# Altium schematic sheet Audio.SchDoc
size Letter
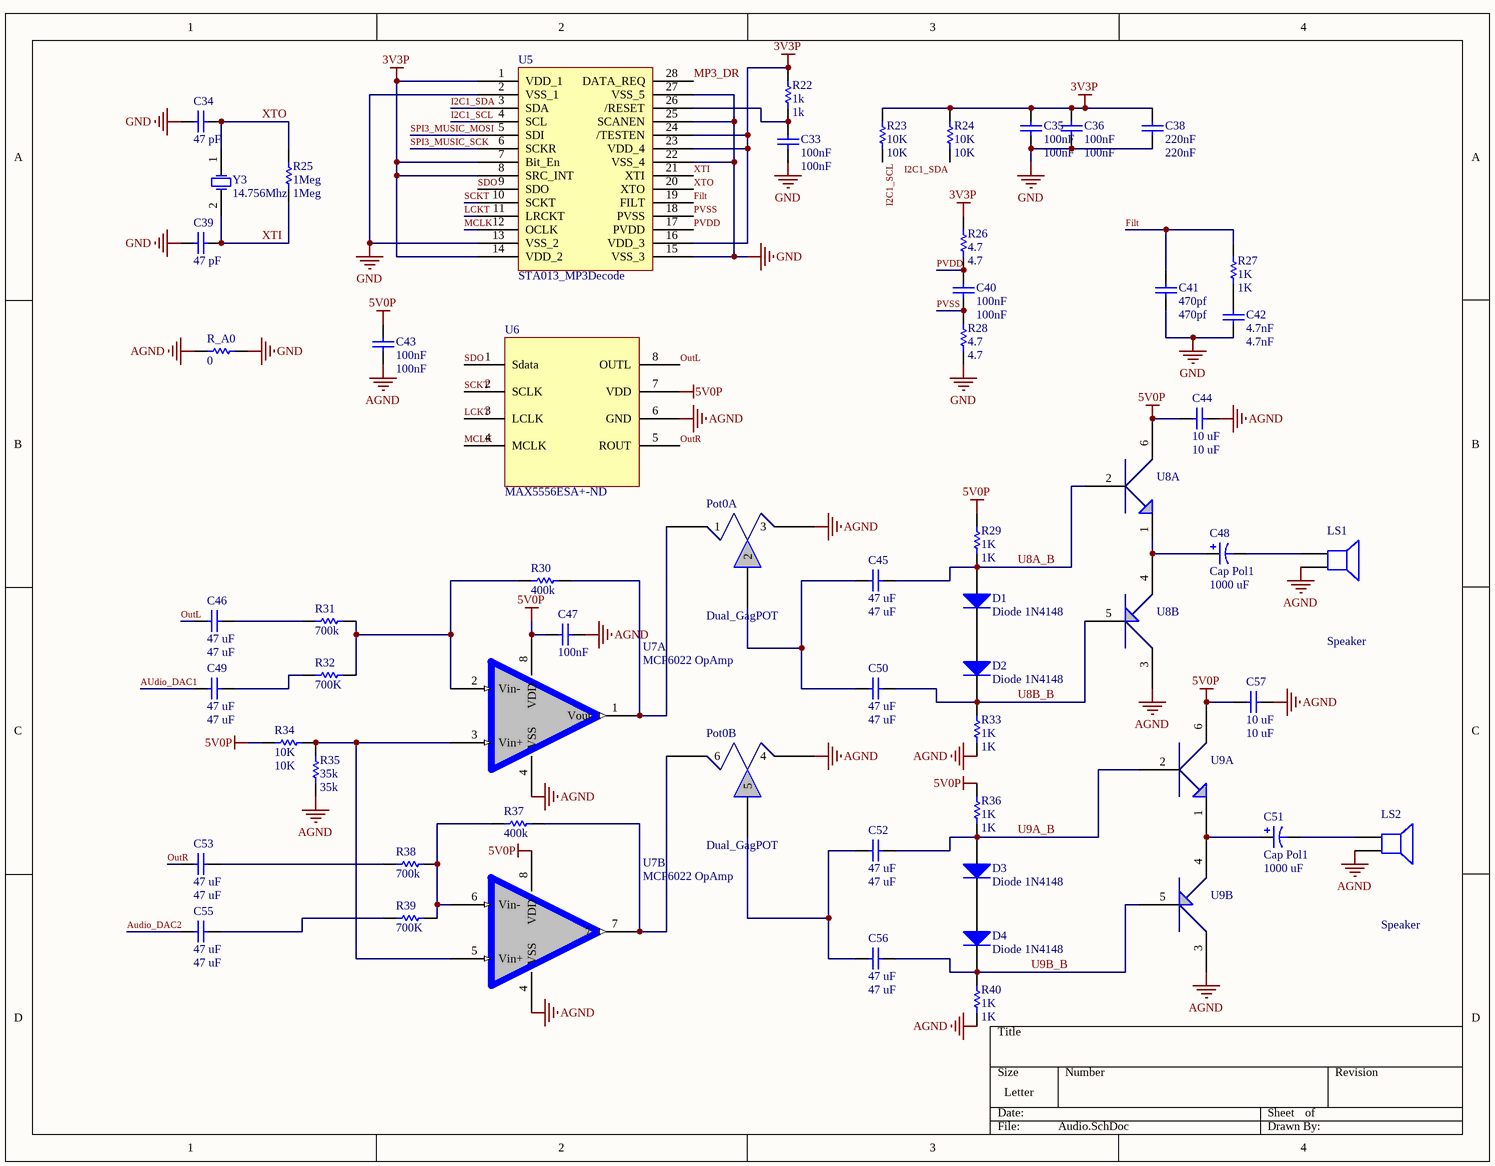
[diagram p0: Audio.SchDoc]

## Parts
C33  100nF  [C0805]
C34  47 pF  [C0805]
C35  100nF  [C0805]
C36  100nF  [C0805]
C38  220nF  [C0805]
C39  47 pF  [C0805]
C40  100nF  [C0805]
C41  470pf  [C0805]
C42  4.7nF  [C0805]
C43  100nF  [C0805]
C44  10 uF  [C0805]
C45  47 uF  [C0805]
C46  47 uF  [C0805]
C47  100nF  [C0805]
C48  Cap Pol1  value 1000 uF  [C2917]
C49  47 uF  [C0805]
C50  47 uF  [C0805]
C51  Cap Pol1  value 1000 uF  [C2917]
C52  47 uF  [C0805]
C53  47 uF  [C0805]
C55  47 uF  [C0805]
C56  47 uF  [C0805]
C57  10 uF  [C0805]
D1  Diode 1N4148  [Diode]
D2  Diode 1N4148  [Diode]
D3  Diode 1N4148  [Diode]
D4  Diode 1N4148  [Diode]
LS1  Speaker  [PIN2]
LS2  Speaker  [PIN2]
Pot0  Dual_GagPOT  [DGPOT]  (parts A,B of 2)
R22  1k  [6-0805_M]
R23  10K  [6-0805_M]
R24  10K  [6-0805_M]
R25  1Meg  [6-0805_M]
R26  4.7  [6-0805_M]
R27  1K  [6-0805_M]
R28  4.7  [6-0805_M]
R29  1K  [6-0805_M]
R30  400k  [6-0805_M]
R31  700k  [6-0805_M]
R32  700K  [6-0805_M]
R33  1K  [6-0805_M]
R34  10K  [6-0805_M]
R35  35k  [6-0805_M]
R36  1K  [6-0805_M]
R37  400k  [6-0805_M]
R38  700k  [6-0805_M]
R39  700K  [6-0805_M]
R40  1K  [6-0805_M]
R_A0  0  [6-0805_M]
U5  STA013_MP3Decode  [SOP28]
U6  MAX5556ESA+-ND  [SOIC8_DAC]
U7  MCP6022 OpAmp  [SOP8_Opamp]  (parts A,B of 2)
U8  BJT  [BJT_SOT6]  (value not drawn)  (parts A,B of 2)
U9  BJT  [BJT_SOT6]  (value not drawn)  (parts A,B of 2)
Y3  14.756Mhz  [HC-49U]

## Nets
3V3P: C35.2 C36.2 C38.2 R22.2 R23.2 R24.2 R26.1 U5.1(VDD_1) U5.7(Bit_En) U5.8(SRC_INT) U5.14(VDD_2) U5.16(VDD_3) U5.23(VDD_4) U5.24(/TESTEN)
5V0P: C43.2 C44.2 C47.1 C57.2 R29.1 R34.1 R36.1 U6.7(VDD) U7.8(VDD) U8.6(Collector) U9.6(Collector)
AGND: C43.1 C44.1 C47.2 C57.1 LS1.2 LS2.2 Pot0.3 Pot0.4 R33.2 R35.1 R40.2 R_A0.1 U6.6(GND) U7.4(VSS) U8.3(Collector) U9.3(Collector)
GND: C33.2 C34.1 C35.1 C36.1 C38.1 C39.1 C41.1 C42.1 R28.2 R_A0.2 U5.2(VSS_1) U5.13(VSS_2) U5.15(VSS_3) U5.22(VSS_4) U5.25(SCANEN) U5.27(VSS_5)
AUdio_DAC1: C49.1
Audio_DAC2: C55.1
Filt: C41.2 R27.1 U5.19(FILT)
I2C1_SCL: R23.1 U5.4(SCL)
I2C1_SDA: R24.1 U5.3(SDA)
LCKT: U5.11(LRCKT) U6.3(LCLK)
MCLK: U5.12(OCLK) U6.4(MCLK)
MP3_DR: U5.28(DATA_REQ)
OutL: C46.1 U6.8(OUTL)
OutR: C53.1 U6.5(ROUT)
PVDD: C40.2 R26.2 U5.17(PVDD)
PVSS: C40.1 R28.1 U5.18(PVSS)
SCKT: U5.10(SCKT) U6.2(SCLK)
SDO: U5.9(SDO) U6.1(Sdata)
SPI3_MUSIC_MOSI: U5.5(SDI)
SPI3_MUSIC_SCK: U5.6(SCKR)
U8A_B: C45.2 D1.A R29.2 U8.2(Base)
U8B_B: C50.2 D2.K R33.1 U8.5(Base)
U9A_B: C52.2 D3.A R36.2 U9.2(Base)
U9B_B: C56.2 D4.K R40.1 U9.5(Base)
XTI: C39.2 R25.1 U5.21(XTI) Y3.2(OSC2)
XTO: C34.2 R25.2 U5.20(XTO) Y3.1(OSC1)
NetC33_1: C33.1 R22.1 U5.26(/RESET)
NetC42_2: C42.2 R27.2
NetC45_1: C45.1 C50.1 Pot0.2
NetC46_2: C46.2 R31.1
NetC48_1: C48.1 U8.1(Emitter) U8.4(Emitter)
NetC48_2: C48.2 LS1.1
NetC49_2: C49.2 R32.1
NetC51_1: C51.1 U9.1(Emitter) U9.4(Emitter)
NetC51_2: C51.2 LS2.1
NetC52_1: C52.1 C56.1 Pot0.5
NetC53_2: C53.2 R38.1
NetC55_2: C55.2 R39.1
NetD1_K: D1.K D2.A
NetD3_K: D3.K D4.A
NetPot0_1: Pot0.1 R30.2 U7.1(Vout)
NetPot0_6: Pot0.6 R37.2 U7.7
NetR30_1: R30.1 R31.2 R32.2 U7.2(Vin-)
NetR34_2: R34.2 R35.2 U7.3(Vin+) U7.5(Vin+)
NetR37_1: R37.1 R38.2 R39.2 U7.6(Vin-)

## Library data of the parts
C33-C36 C38-C47 C49 C50 C52 C53 C55-C57 = Cap: Capacitor; Published: 8-Jun-2000; LatestRevisionDate: 17-Jul-2002; LatestRevisionNote: Re-released for DXP Platform.; PackageReference: RAD-0.3; Publisher: Altium Limited; PackageDescription: Radial Cap, Thru-Hole; 2 Leads; 0.3 in Pin Spacing
  C33 C35 C36 C40 C43 C47: Value: 100nF
  C34 C39: Value: 47 pF
  C38: Value: 220nF
  C41: Value: 470pf
  C42: Value: 4.7nF
  C44 C57: Value: 10 uF
  C45 C46 C49 C50 C52 C53 C55 C56: Value: 47 uF
C48 C51 = Cap Pol1: Polarized Capacitor (Radial); Published: 8-Jun-2000; LatestRevisionDate: 17-Jul-2002; LatestRevisionNote: Re-released for DXP Platform.; PackageReference: RB7.6-15; Publisher: Altium Limited; PackageDescription: Polarized Capacitor (Radial); 2 Leads
D1-D4 = Diode 1N4148: High Conductance Fast Diode; Published: 8-Jun-2000; LatestRevisionDate: 17-Jul-2002; LatestRevisionNote: Re-released for DXP Platform.; DatasheetVersion: 1997; PackageReference: DO-35; Publisher: Altium Limited; PackageDescription: Diode, Axial; Body 3.8 x 1.9 mm (LxDia. max), Lead Dia. 0.53 mm (max); Code_JEDEC: DO-204-AH; ComponentLink1Description: Manufacturer Link; ComponentLink1URL: http://www.fairchildsemi.com/; ComponentLink2Description: Datasheet; ComponentLink2URL: http://www.fairchildsemi.com/ds/1N%2F1N4148.pdf
LS1 LS2 = Speaker: Loudspeaker; Published: 24-Mar-1999; LatestRevisionDate: 17-Jul-2002; LatestRevisionNote: Re-released for DXP Platform.; PackageReference: PIN2; Publisher: Altium Limited
R22-R40 R_A0 = Res1: Resistor; Published: 8-Jun-2000; LatestRevisionDate: 17-Jul-2002; LatestRevisionNote: Re-released for DXP Platform.; PackageReference: AXIAL-0.3; Publisher: Altium Limited; PackageDescription: Axial Device, Thru-Hole; 2 Leads; 0.3 in Pin Spacing
  R22: Value: 1k
  R23 R24 R34: Value: 10K
  R25: Value: 1Meg
  R26 R28: Value: 4.7
  R27 R29 R33 R36 R40: Value: 1K
  R30 R37: Value: 400k
  R31 R38: Value: 700k
  R32 R39: Value: 700K
  R35: Value: 35k
  R_A0: Value: 0
Y3 = XTAL: Crystal Oscillator; Published: 8-Jun-2000; LatestRevisionDate: 17-Jul-2002; LatestRevisionNote: Re-released for DXP Platform.; PackageReference: R38; Publisher: Altium Limited; PackageDescription: Crystal, Thru-Hole; 2 Leads; Body 3.1 x 8.2 mm (Dia.xH)